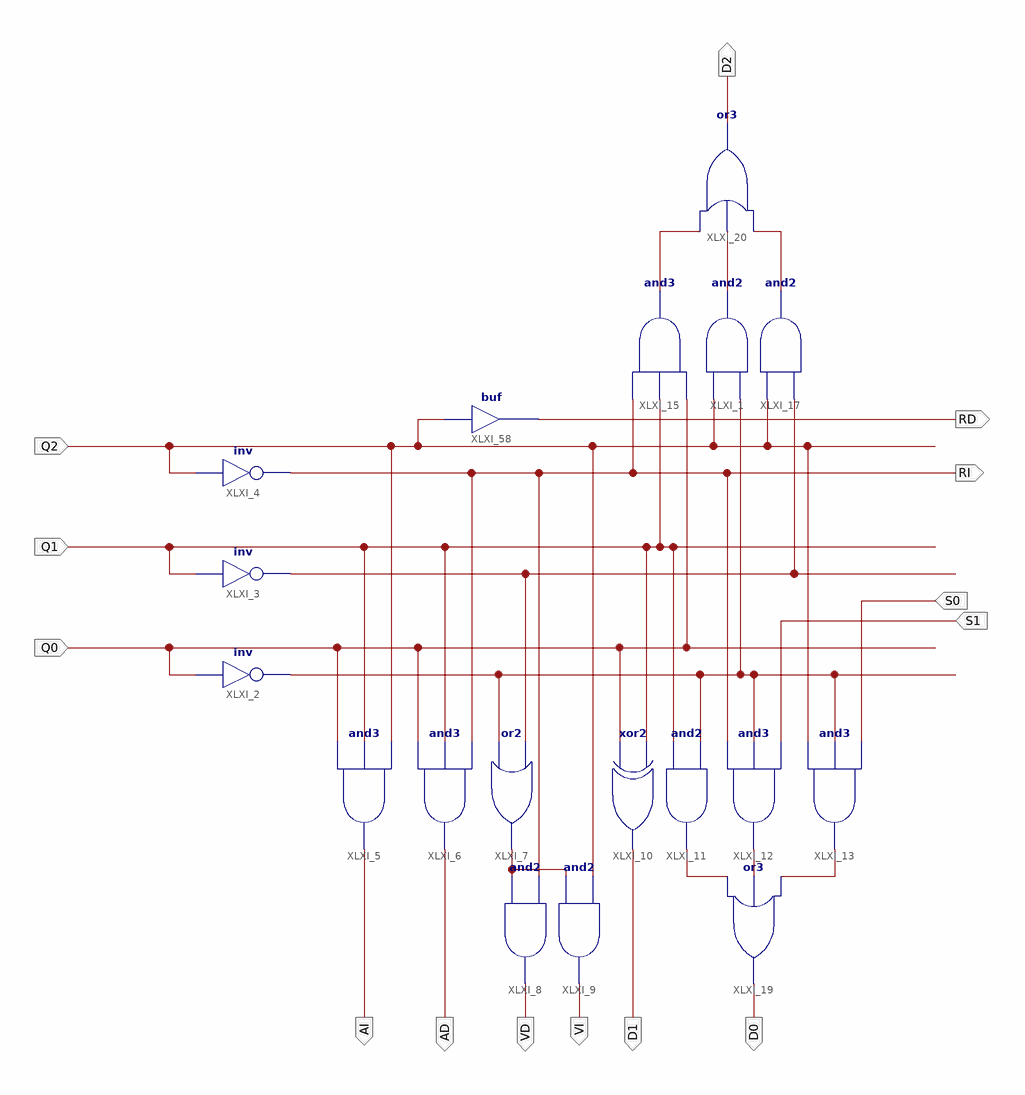
[diagram p0: schematic sheet 1]
// Xilinx ISE schematic control_obras.sch (spartan3) as structural Verilog: 18 symbols, 14 ports
module control_obras (
  input  Q2,
  input  Q1,
  input  Q0,
  input  S1,
  input  S0,
  output RI,
  output RD,
  output D2,
  output AI,
  output VD,
  output AD,
  output VI,
  output D1,
  output D0
);

  wire XLXN_4, XLXN_5, XLXN_7, XLXN_12, XLXN_13, XLXN_14, XLXN_33, XLXN_34, XLXN_35;

  and XLXI_1 (XLXN_13, XLXN_5, Q2);
  not XLXI_2 (XLXN_5, Q0);
  not XLXI_3 (XLXN_4, Q1);
  not XLXI_4 (RI, Q2);
  and XLXI_5 (AI, Q0, Q1, Q2);
  and XLXI_6 (AD, Q0, Q1, RI);
  or XLXI_7 (XLXN_7, XLXN_5, XLXN_4);
  and XLXI_8 (VD, XLXN_7, RI);
  and XLXI_9 (VI, XLXN_7, Q2);
  xor XLXI_10 (D1, Q0, Q1);
  and XLXI_11 (XLXN_33, Q1, XLXN_5);
  and XLXI_12 (XLXN_34, RI, XLXN_5, S1);
  and XLXI_13 (XLXN_35, Q2, XLXN_5, S0);
  or XLXI_19 (D0, XLXN_33, XLXN_34, XLXN_35);
  and XLXI_15 (XLXN_12, Q0, Q1, RI);
  or XLXI_20 (D2, XLXN_14, XLXN_13, XLXN_12);
  and XLXI_17 (XLXN_14, XLXN_4, Q2);
  buf XLXI_58 (RD, Q2);
endmodule
